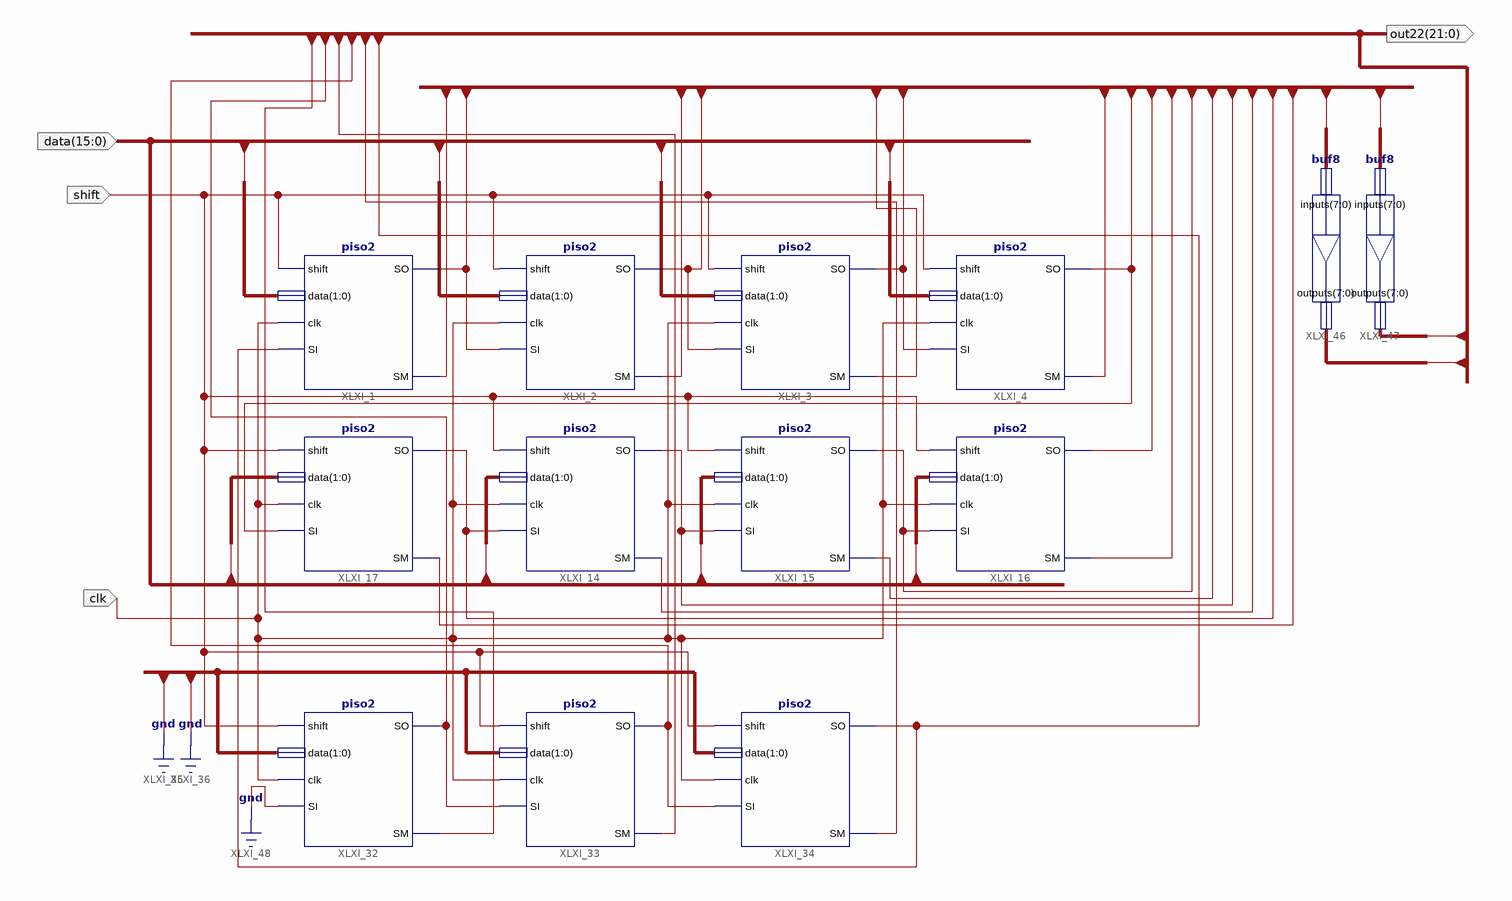
[diagram p0: schematic sheet 1]
// Xilinx ISE schematic piso16_22.sch (spartan6) as structural Verilog: 13 symbols, 4 ports
module piso16_22 (
  input  clk,
  input  shift,
  input  [15:0] data,
  output [21:0] out22
);

  wire [15:0] data_out;

  piso2 XLXI_34 (.shift(shift), .data(2'b00), .clk(clk), .SI(out22[3]), .SM(out22[4]), .SO(out22[5]));
  piso2 XLXI_33 (.shift(shift), .data(2'b00), .clk(clk), .SI(out22[1]), .SM(out22[2]), .SO(out22[3]));
  piso2 XLXI_32 (.shift(shift), .data(2'b00), .clk(clk), .SI(1'b0), .SM(out22[0]), .SO(out22[1]));
  piso2 XLXI_1 (.shift(shift), .data(data[1:0]), .clk(clk), .SI(out22[5]), .SM(data_out[0]), .SO(data_out[1]));
  piso2 XLXI_16 (.shift(shift), .data(data[15:14]), .clk(clk), .SI(data_out[13]), .SM(data_out[14]), .SO(data_out[15]));
  piso2 XLXI_4 (.shift(shift), .data(data[7:6]), .clk(clk), .SI(data_out[5]), .SM(data_out[6]), .SO(data_out[7]));
  piso2 XLXI_17 (.shift(shift), .data(data[9:8]), .clk(clk), .SI(data_out[7]), .SM(data_out[8]), .SO(data_out[9]));
  piso2 XLXI_15 (.shift(shift), .data(data[13:12]), .clk(clk), .SI(data_out[11]), .SM(data_out[12]), .SO(data_out[13]));
  piso2 XLXI_3 (.shift(shift), .data(data[5:4]), .clk(clk), .SI(data_out[3]), .SM(data_out[4]), .SO(data_out[5]));
  piso2 XLXI_14 (.shift(shift), .data(data[11:10]), .clk(clk), .SI(data_out[9]), .SM(data_out[10]), .SO(data_out[11]));
  piso2 XLXI_2 (.shift(shift), .data(data[3:2]), .clk(clk), .SI(data_out[1]), .SM(data_out[2]), .SO(data_out[3]));
  buf8 XLXI_46 (.inputs(data_out[15:8]), .outputs(out22[21:14]));
  buf8 XLXI_47 (.inputs(data_out[7:0]), .outputs(out22[13:6]));
endmodule
